# Altium schematic sheet 8bit-counter.SchDoc
size B; SheetNumber: 1; SheetTotal: 1
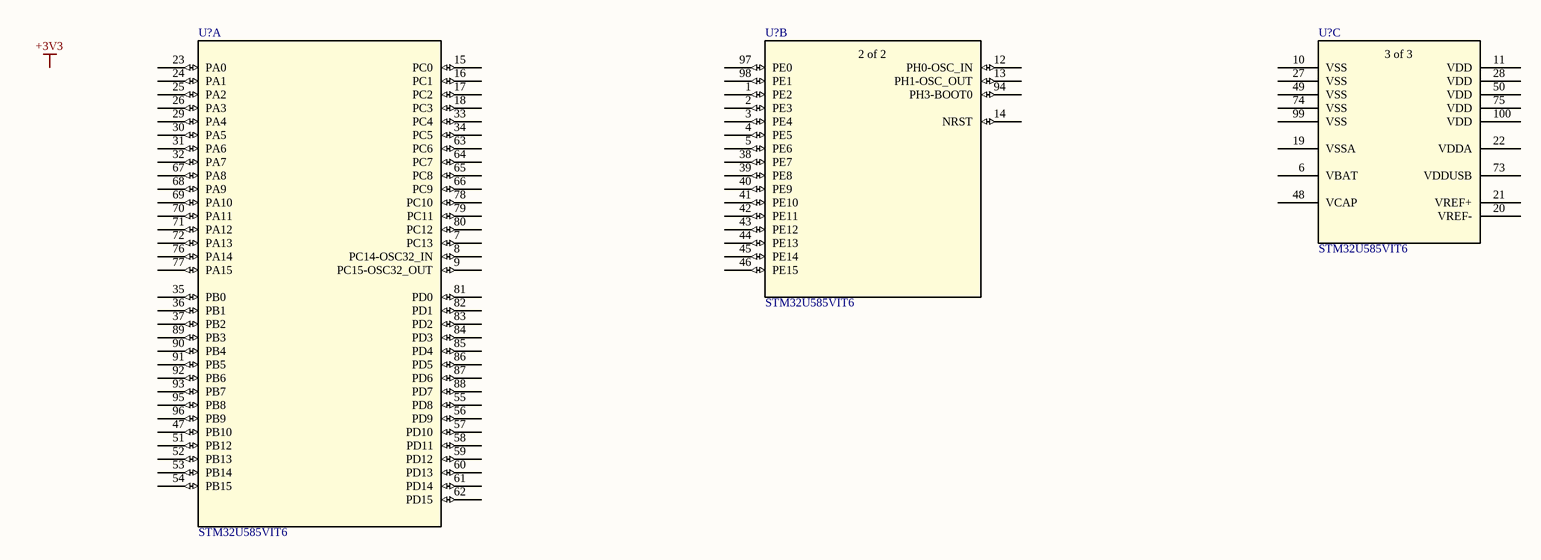
[diagram p0: 8bit-counter.SchDoc]

## Parts
(Parts that share a designator on the sheet are numbered #1, #2 ... from top to bottom, then left to right.)
U?#1  STM32U585VIT6  [LQFP-100_STM]  (part A of 3)
U?#2  STM32U585VIT6  [LQFP-100_STM]  (part B of 3)
U?#3  STM32U585VIT6  [LQFP-100_STM]  (part C of 3)

## Nets

Not connected (* = marked no-connect by the designer): U?#1 7(PC13) 8(PC14-OSC32_IN) 9(PC15-OSC32_OUT) 15(PC0) 16(PC1) 17(PC2) 18(PC3) 23(PA0) 24(PA1) 25(PA2) 26(PA3) 29(PA4) 30(PA5) 31(PA6) 32(PA7) 33(PC4) 34(PC5) 35(PB0) 36(PB1) 37(PB2) 47(PB10) 51(PB12) 52(PB13) 53(PB14) 54(PB15) 55(PD8) 56(PD9) 57(PD10) 58(PD11) 59(PD12) 60(PD13) 61(PD14) 62(PD15) 63(PC6) 64(PC7) 65(PC8) 66(PC9) 67(PA8) 68(PA9) 69(PA10) 70(PA11) 71(PA12) 72(PA13) 76(PA14) 77(PA15) 78(PC10) 79(PC11) 80(PC12) 81(PD0) 82(PD1) 83(PD2) 84(PD3) 85(PD4) 86(PD5) 87(PD6) 88(PD7) 89(PB3) 90(PB4) 91(PB5) 92(PB6) 93(PB7) 95(PB8) 96(PB9); U?#2 1(PE2) 2(PE3) 3(PE4) 4(PE5) 5(PE6) 12(PH0-OSC_IN) 13(PH1-OSC_OUT) 14(NRST) 38(PE7) 39(PE8) 40(PE9) 41(PE10) 42(PE11) 43(PE12) 44(PE13) 45(PE14) 46(PE15) 94(PH3-BOOT0) 97(PE0) 98(PE1); U?#3 6(VBAT) 10(VSS) 11(VDD) 19(VSSA) 20(VREF-) 21(VREF+) 22(VDDA) 27(VSS) 28(VDD) 48(VCAP) 49(VSS) 50(VDD) 73(VDDUSB) 74(VSS) 75(VDD) 99(VSS) 100(VDD)

## Notes on the sheet
- Labels drawn without touching a wire or pin: +3V3
- (in symbol STM32U585VIT6, part B) 2 of 2
- (in symbol STM32U585VIT6, part C) 3 of 3

## Library data of the parts
U?#1-U?#3 = STM32U585VIT6: No Description Available; Mfr_Name: STMicroelectronics; RefDes: RefDes; Type: Type